# Altium schematic sheet IPM_VFD.SchDoc
size A4; SheetNumber: 1; SheetTotal: 1
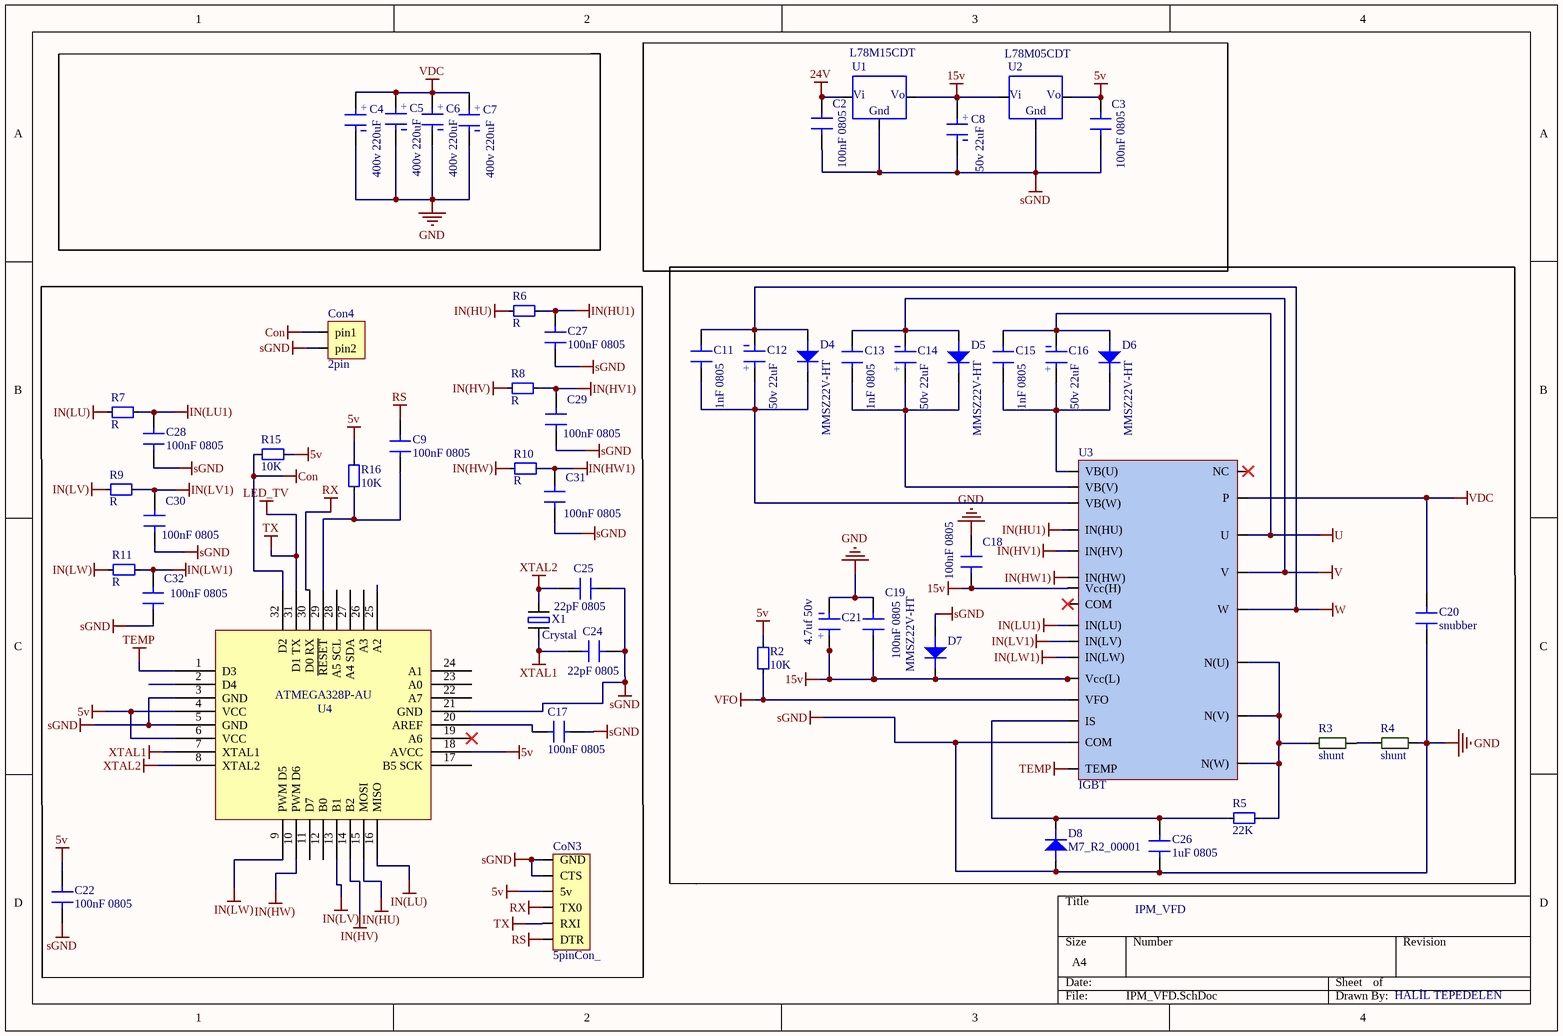
[diagram p0: IPM_VFD.SchDoc]

## Parts
C2  100nF 0805  [C-0805R]
C3  100nF 0805  [C-0805R]
C4  400v 220uF  [400 220Uf]
C5  400v 220uF  [400 220Uf]
C6  400v 220uF  [400 220Uf]
C7  400v 220uF  [400 220Uf]
C8  50v 22uF  [50v 22uf]
C9  100nF 0805  [C-0805R]
C11  1nF 0805  [C-0805R]
C12  50v 22uF  [50v 22uf]
C13  1nF 0805  [C-0805R]
C14  50v 22uF  [50v 22uf]
C15  1nF 0805  [C-0805R]
C16  50v 22uF  [50v 22uf]
C17  100nF 0805  [C-0805R]
C18  100nF 0805  [C-0805R]
C19  100nF 0805  [C-0805R]
C20  snubber  [snubber]
C21  4.7uf 50v  [4x5.3 cap]
C22  100nF 0805  [C-0805R]
C24  22pF 0805  [C-0805R]
C25  22pF 0805  [C-0805R]
C26  1uF 0805  [C-0805R]
C27  100nF 0805  [C-0805R]
C28  100nF 0805  [C-0805R]
C29  100nF 0805  [C-0805R]
C30  100nF 0805  [C-0805R]
C31  100nF 0805  [C-0805R]
C32  100nF 0805  [C-0805R]
CoN3  5pinCon_  [5pinCon]
Con4  2pin  [Contactor]
D4  MMSZ22V-HT  [SOD123]
D5  MMSZ22V-HT  [SOD123]
D6  MMSZ22V-HT  [SOD123]
D7  MMSZ22V-HT  [SOD123]
D8  M7_R2_00001  [DO-214AC]
R2  10K  [R-0805R]
R3  shunt  [shunt]
R4  shunt  [shunt]
R5  22K  [R-0805R]
R6  R  [R-0805R]
R7  R  [R-0805R]
R8  R  [R-0805R]
R9  R  [R-0805R]
R10  R  [R-0805R]
R11  R  [R-0805R]
R15  10K  [R-0805R]
R16  10K  [R-0805R]
U1  L78M15CDT  [TO-252]
U2  L78M05CDT  [TO-252]
U3  IGBT  [6MBP20XSF06050P]
U4  ATMEGA328P-AU  [TQFP80P900X900X120-32N]
X1  Crystal  [crystal]

## Nets
5v: C3.2 C22.1 CoN3.4(5v) R2.2 R15.1 R16.1 U2.2 U4.4(VCC) U4.6(VCC) U4.18(AVCC)
15v: C8.1 C18.1 C19.1 C21.1 D7.k U1.2 U2.1 U3.12(Vcc(H)) U3.17(Vcc(L))
24V: C2.2 U1.1
Con: Con4.1(pin1) R15.2 U4.32(D2)
GND: C2.1 C3.1 C4.1 C5.1 C6.1 C7.1 C8.2 C17.2 C18.2 C19.2 C20.2 C21.2 C22.2 C24.2 C25.2 C26.2 C27.2 C28.2 C29.1 C30.1 C31.1 C32.1 CoN3.5(CTS) CoN3.6(GND) Con4.2(pin2) D7.a D8.a R4.2 U1.3 U2.3 U3.20(COM) U4.3(GND) U4.5(GND) U4.21(GND)  [also labelled sGND]
IN(HU1): C27.1 R6.2 U3.9(IN(HU))
IN(HU): R6.1 U4.15(MOSI)
IN(HV1): C29.2 R8.2 U3.10(IN(HV))
IN(HV): R8.1 U4.14(B2)
IN(HW1): C31.2 R10.2 U3.11(IN(HW))
IN(HW): R10.1 U4.10(PWM_D6)
IN(LU1): C28.1 R7.2 U3.14(IN(LU))
IN(LU): R7.1 U4.16(MISO)
IN(LV1): C30.2 R9.2 U3.15(IN(LV))
IN(LV): R9.1 U4.13(B1)
IN(LW1): C32.2 R11.2 U3.16(IN(LW))
IN(LW): R11.1 U4.9(PWM_D5)
LED_TV: CoN3.2(RXI) U4.31(D1_TX)  [also labelled TX]
RS: C9.2 CoN3.1(DTR)
RX: CoN3.3(TX0) U4.30(D0_RX)
TEMP: U3.21(TEMP) U4.1(D3)
U: C15.1 C16.2 D6.a U3.30(U)
V: C13.1 C14.2 D5.a U3.28(V)
VDC: C4.2 C5.2 C6.2 C7.2 C20.1 U3.32(P)
VFO: R2.1 U3.18(VFO)
W: C11.1 C12.2 D4.a U3.26(W)
XTAL1: C24.1 U4.7(XTAL1) X1.1
XTAL2: C25.1 U4.8(XTAL2) X1.2
NetC9_1: C9.1 R16.2 U4.29(~{RESET})
NetC11_2: C11.2 C12.1 D4.k U3.7(VB(W))
NetC13_2: C13.2 C14.1 D5.k U3.5(VB(V))
NetC15_2: C15.2 C16.1 D6.k U3.3(VB(U))
NetC17_1: C17.1 U4.20(AREF)
NetC26_1: C26.1 D8.k R5.1 U3.19(IS)
NetR3_1: R3.1 R5.2 U3.22(N(W)) U3.23(N(V)) U3.24(N(U))
NetR3_2: R3.2 R4.1

Not connected (* = marked no-connect by the designer): U3 13(COM)* 36(NC)*; U4 2(D4) 11(D7) 12(B0) 17(B5_SCK) 19(A6)* 22(A7) 23(A0) 24(A1) 25(A2) 26(A3) 27(A4_SDA) 28(A5_SCL)

## Notes on the sheet
- (near C26) IPM_VFD
- HALİL TEPEDELEN
- (in symbol 4.7uf 50v) +
- (in symbol 50v 22uF) +
- (in symbol 400v 220uF) +
- (in symbol L78M05) Vi; Vo; Gnd
- (in symbol L78M15CDT) Vi; Vo; Gnd

## Library data of the parts
C2 C3 C9 C17-C19 C22 C27-C32 = 100nF 0805: Manufacturer: Nichicon; Manufacturer Part Number: LKS1J472MESZ; Voltage Rating: 63V; Tolerance: 20%; Ripple Current: 3A; Life (Hours): 1000Hour; Supplier 1: Mouser; RoHS: Yes; Mount: Through Hole; Case/Package: Radial; Min Operating Temperature: -40°C; Max Operating Temperature: 85°C; Package Quantity: 250; Packaging: Bulk; Voltage Rating (DC): 63V; Termination: Snap in; Diameter: 22mm; Length: 45mm; Lead Pitch: 0.394inch; Height - Seated (Max): 1.772inch; Supplier Part Number 1: 647-LKS1J472MESZ; ComponentLink2Description: Link; ComponentLink2URL: https://ozdisan.com/Product/Detail/342152/CL21F104ZBANNNC
C4-C7 = 400v 220uF: Manufacturer: Nichicon; Manufacturer Part Number: LKS1J472MESZ; Capacitance: 4.7mF; Voltage Rating: 63V; Tolerance: 20%; Ripple Current: 3A; Life (Hours): 1000Hour; Supplier 1: Mouser; RoHS: Yes; Mount: Through Hole; Case/Package: Radial; Min Operating Temperature: -40°C; Max Operating Temperature: 85°C; Package Quantity: 250; Packaging: Bulk; Voltage Rating (DC): 63V; Termination: Snap in; Diameter: 22mm; Length: 45mm; Lead Pitch: 0.394inch; Height - Seated (Max): 1.772inch; Supplier Part Number 1: 647-LKS1J472MESZ; ComponentLink2Description: https://www.ozdisan.com/pasif-komponentler/kondansatorler/aluminyum-kondansatorler/PKL5-063V472MM450; ComponentLink2URL: https://www.ozdisan.com/pasif-komponentler/kondansatorler/aluminyum-kondansatorler/PKL5-063V472MM450
C8 C12 C14 C16 = 50v 22uF: Manufacturer: Nichicon; Manufacturer Part Number: LKS1J472MESZ; Capacitance: 4.7mF; Voltage Rating: 63V; Tolerance: 20%; Ripple Current: 3A; Life (Hours): 1000Hour; Supplier 1: Mouser; RoHS: Yes; Mount: Through Hole; Case/Package: Radial; Min Operating Temperature: -40°C; Max Operating Temperature: 85°C; Package Quantity: 250; Packaging: Bulk; Voltage Rating (DC): 63V; Termination: Snap in; Diameter: 22mm; Length: 45mm; Lead Pitch: 0.394inch; Height - Seated (Max): 1.772inch; Supplier Part Number 1: 647-LKS1J472MESZ; ComponentLink3Description: Link; ComponentLink3URL: https://ozdisan.com/passive-components/capacitors/aluminum-capacitors/MRW-050V220ME057-TR
C11 C13 C15 = 1nF 0805: Manufacturer: Nichicon; Manufacturer Part Number: LKS1J472MESZ; Voltage Rating: 63V; Tolerance: 20%; Ripple Current: 3A; Life (Hours): 1000Hour; Supplier 1: Mouser; RoHS: Yes; Mount: Through Hole; Case/Package: Radial; Min Operating Temperature: -40°C; Max Operating Temperature: 85°C; Package Quantity: 250; Packaging: Bulk; Voltage Rating (DC): 63V; Termination: Snap in; Diameter: 22mm; Length: 45mm; Lead Pitch: 0.394inch; Height - Seated (Max): 1.772inch; Supplier Part Number 1: 647-LKS1J472MESZ; ComponentLink1Description: Link; ComponentLink1URL: https://ozdisan.com/passive-components/capacitors/smt-smd-and-mlcc-capacitors/CL21B102KBANNNC
C20 = snubber: Manufacturer: Nichicon; Manufacturer Part Number: LKS1J472MESZ; Voltage Rating: 63V; Tolerance: 20%; Ripple Current: 3A; Life (Hours): 1000Hour; Supplier 1: Mouser; RoHS: Yes; Mount: Through Hole; Case/Package: Radial; Min Operating Temperature: -40°C; Max Operating Temperature: 85°C; Package Quantity: 250; Packaging: Bulk; Voltage Rating (DC): 63V; Termination: Snap in; Diameter: 22mm; Length: 45mm; Lead Pitch: 0.394inch; Height - Seated (Max): 1.772inch; Supplier Part Number 1: 647-LKS1J472MESZ
C24 C25 = 22pF 0805: Manufacturer: Nichicon; Manufacturer Part Number: LKS1J472MESZ; Voltage Rating: 63V; Tolerance: 20%; Ripple Current: 3A; Life (Hours): 1000Hour; Supplier 1: Mouser; RoHS: Yes; Mount: Through Hole; Case/Package: Radial; Min Operating Temperature: -40°C; Max Operating Temperature: 85°C; Package Quantity: 250; Packaging: Bulk; Voltage Rating (DC): 63V; Termination: Snap in; Diameter: 22mm; Length: 45mm; Lead Pitch: 0.394inch; Height - Seated (Max): 1.772inch; Supplier Part Number 1: 647-LKS1J472MESZ; ComponentLink1Description: Link; ComponentLink1URL: https://ozdisan.com/passive-components/capacitors/smt-smd-and-mlcc-capacitors/CL21C220JCANNNC
C26 = 1uF 0805: Manufacturer: Nichicon; Manufacturer Part Number: LKS1J472MESZ; Voltage Rating: 63V; Tolerance: 20%; Ripple Current: 3A; Life (Hours): 1000Hour; Supplier 1: Mouser; RoHS: Yes; Mount: Through Hole; Case/Package: Radial; Min Operating Temperature: -40°C; Max Operating Temperature: 85°C; Package Quantity: 250; Packaging: Bulk; Voltage Rating (DC): 63V; Termination: Snap in; Diameter: 22mm; Length: 45mm; Lead Pitch: 0.394inch; Height - Seated (Max): 1.772inch; Supplier Part Number 1: 647-LKS1J472MESZ
R2 R15 R16 = 10K 0805
R3 R4 = shunt: Res1206
R5 = 22K 0805
R6-R11 = R 0805
U1 = L78M15CDT: Manufacturer: STMicroelectronics; Max Output Current: 500mA; Output Voltage: 15V; Number of Outputs: 1; Max Input Voltage: 35V; Polarity: Positive; Quiescent Current: 6mA; Output Type: Fixed; Dropout Voltage: 2V; Supplier 1: Avnet; Manufacturer Part Number: L78M15CDT; RoHS: Yes; Mount: Surface Mount; Case/Package: DPAK; Number of Pins: 3; Min Operating Temperature: 0°C; Max Operating Temperature: 150°C; Packaging: Rail/Tube; Output Current: 500mA; Min Input Voltage: 35V; Package Quantity: 75; Length: 6.6mm; Height: 2.4mm; Width: 6.2mm; Radiation Hardening: No; Supplier Part Number 1: L78M15CDT; ComponentLink1Description: link; ComponentLink1URL: https://karakoyelektronik.com/regulator/ua78m15-21734
U2 = L78M05: Manufacturer: STMicroelectronics; Manufacturer Part Number: L78M15CDT; Max Output Current: 500mA; Output Voltage: 15V; Number of Outputs: 1; Max Input Voltage: 35V; Polarity: Positive; Quiescent Current: 6mA; Output Type: Fixed; Dropout Voltage: 2V; Supplier 1: Avnet; RoHS: Yes; Mount: Surface Mount; Case/Package: DPAK; Number of Pins: 3; Min Operating Temperature: 0°C; Max Operating Temperature: 150°C; Packaging: Rail/Tube; Output Current: 500mA; Min Input Voltage: 35V; Package Quantity: 75; Length: 6.6mm; Height: 2.4mm; Width: 6.2mm; Radiation Hardening: No; Supplier Part Number 1: L78M15CDT; ComponentLink1Description: Link; ComponentLink1URL: https://ozdisan.com/integrated-circuits-ics/power-management-ics/linear-voltage-regulators/MC7805BDTRKG
U3 = 6mbp20xsf060-50
U4 = ATMEGA328P-AU: Microchip Technology ATMEGA328P-AN, 8bit AVR Microcontroller, 20MHz, 32 kB Flash, 32-Pin TQFP
X1 = Crystal: AS49SD-16M-FC160F3-TR
D4-D7 = MMSZ22V-HT: ComponentLink1Description: Link; ComponentLink1URL: https://ozdisan.com/power-semiconductors/diodes-diode-modules-and-rectifiers/zener-diodes/MMSZ22V-HT
D8 = M7_R2_00001: ComponentLink1Description: Link; ComponentLink1URL: https://ozdisan.com/power-semiconductors/diodes-diode-modules-and-rectifiers/general-purpose-diodes/M7R200001